# EAGLE design 608_donkey_nodisplay (EAGLE 9.6.2)
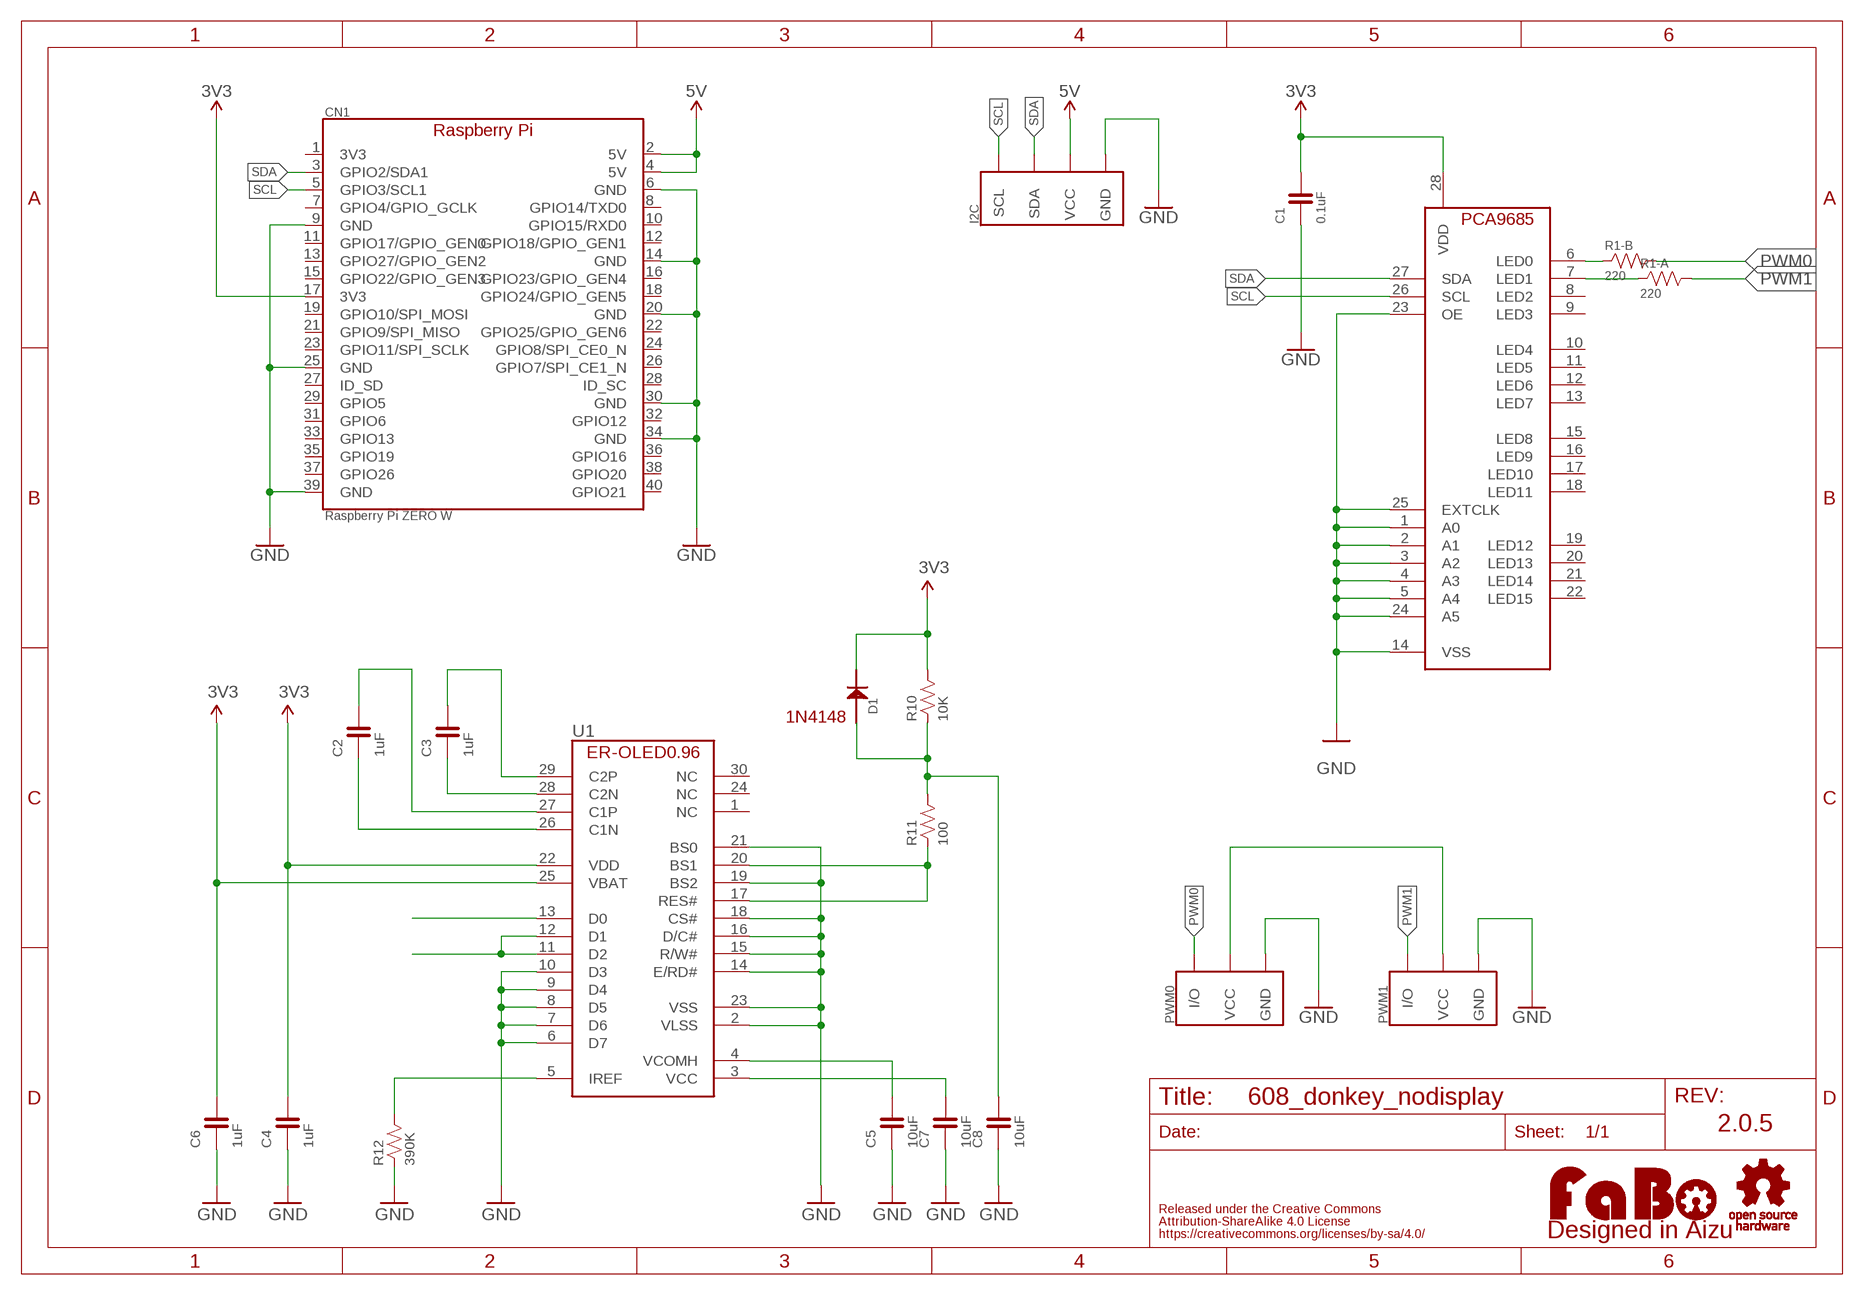
[diagram p0: schematic, sheet 1]

## Parts
C1  0.1uF  CAPACITOR-0603  [EIA0603]
C2  1uF  CAPACITOR-0603-BOTTOM  [0603-BOTTOM]
C3  1uF  CAPACITOR-0603-BOTTOM  [0603-BOTTOM]
C4  1uF  CAPACITOR-0603-BOTTOM  [0603-BOTTOM]
C5  10uF  CAPACITOR-0603-BOTTOM  [0603-BOTTOM]
C6  1uF  CAPACITOR-0603-BOTTOM  [0603-BOTTOM]
C7  10uF  CAPACITOR-0603-BOTTOM  [0603-BOTTOM]
C8  10uF  CAPACITOR-0603-BOTTOM  [0603-BOTTOM]
CN1  Raspberry Pi ZERO W  RASPBERRY_CON  [PIN_2X20_NARROW]
D1  1N4148  [1N4148W]
I2C  FABO-BRICK-I2C_SIDE_SMD_BOSS  [SM04B-PASS-1]
LOGO1  LOGO_FABO-M  [LOGO_FABO_M]
PWM0  FABO-BRICK-3PIN_HEADER  [PIN_1X3_NARROW]
PWM1  FABO-BRICK-3PIN_HEADER  [PIN_1X3_NARROW]
R1  220  RESISTOR_ARRAY_2  [EXBV4V]
R10  10K  RESISTOR-0603-BOTTOM  [0603-BOTTOM]
R11  100  RESISTOR-0603-BOTTOM  [0603-BOTTOM]
R12  390K  RESISTOR-0603-BOTTOM  [0603-BOTTOM]
U1  ER-OLED0.96-1ER-CON30HT-1  [ER-CON30HT-1]
U$4  PCA9685_BOTTOM  [PCA9685_BOTTOM]
U$5  LOGO_OSHW-M_BOTTOM  [LOGO_OSHW_M_BOTTOM]

## Nets
3V3: C1.2 C6.2 CN1.17(3V3) D1.CATHODE R10.2 U1.25(VBAT) U$4.28(VDD)
5V: CN1.2(5V) CN1.4(5V) I2C.3(VCC)
GND: C1.1 C4.1 C5.1 C6.1 C7.1 C8.1 CN1.6(GND) CN1.9(GND) CN1.14(GND) CN1.20(GND) CN1.25(GND) CN1.30(GND) CN1.34(GND) CN1.39(GND) I2C.4(GND) PWM0.3(GND) PWM1.3(GND) R12.1 U1.2(VLSS) U1.6(D7) U1.7(D6) U1.8(D5) U1.9(D4) U1.10(D3) U1.14(E/RD#) U1.15(R/W#) U1.16(D/C#) U1.18(CS#) U1.19(BS2) U1.21(BS0) U1.23(VSS) U$4.1(A0) U$4.2(A1) U$4.3(A2) U$4.4(A3) U$4.5(A4) U$4.14(VSS) U$4.23(OE) U$4.24(A5) U$4.25(EXTCLK)
N$1: PWM0.2(VCC) PWM1.2(VCC)
N$4: R1.2 U$4.6(LED0)
N$5: R1.1 U$4.7(LED1)
N$7: C2.1 U1.26(C1N)
N$14: C2.2 U1.27(C1P)
N$19: C3.1 U1.28(C2N)
N$21: C3.2 U1.29(C2P)
N$23: R12.2 U1.5(IREF)
N$24: C5.2 U1.4(VCOMH)
N$25: C7.2 U1.3(VCC)
N$26: R11.1 U1.17(RES#) U1.20(BS1)
N$27: C8.2 D1.ANODE R10.1 R11.2
N$30: C4.2 U1.22(VDD) ; supply symbol labelled 3V3
PWM0: PWM0.1(I/O) R1.3
PWM1: PWM1.1(I/O) R1.4
SCL: CN1.5(GPIO3/SCL1) I2C.1(SCL) U1.13(D0) U$4.26(SCL)
SDA: CN1.3(GPIO2/SDA1) I2C.2(SDA) U1.11(D2) U1.12(D1) U$4.27(SDA)
Unconnected: CN1.1(3V3) CN1.7(GPIO4/GPIO_GCLK) CN1.8(GPIO14/TXD0) CN1.10(GPIO15/RXD0) CN1.11(GPIO17/GPIO_GEN0) CN1.12(GPIO18/GPIO_GEN1) CN1.13(GPIO27/GPIO_GEN2) CN1.15(GPIO22/GPIO_GEN3) CN1.16(GPIO23/GPIO_GEN4) CN1.18(GPIO24/GPIO_GEN5) CN1.19(GPIO10/SPI_MOSI) CN1.21(GPIO9/SPI_MISO) CN1.22(GPIO25/GPIO_GEN6) CN1.23(GPIO11/SPI_SCLK) CN1.24(GPIO8/SPI_CE0_N) CN1.26(GPIO7/SPI_CE1_N) CN1.27(ID_SD) CN1.28(ID_SC) CN1.29(GPIO5) CN1.31(GPIO6) CN1.32(GPIO12) CN1.33(GPIO13) CN1.35(GPIO19) CN1.36(GPIO16) CN1.37(GPIO26) CN1.38(GPIO20) CN1.40(GPIO21) U1.1(NC) U1.24(NC) U1.30(NC) U$4.8(LED2) U$4.9(LED3) U$4.10(LED4) U$4.11(LED5) U$4.12(LED6) U$4.13(LED7) U$4.15(LED8) U$4.16(LED9) U$4.17(LED10) U$4.18(LED11) U$4.19(LED12) U$4.20(LED13) U$4.21(LED14) U$4.22(LED15)

## Notes on the sheet
- 1N4148
- 2.0.5

## Library data of the parts
C1 = component:CAPACITOR
C2-C8 = FaBo-Capacitor:CAPACITOR: CAPACITOR
CN1 = component:RASPBERRY_CON
D1 = FaBo-Diode:1N4148
I2C = component:FABO-BRICK-I2C
LOGO1 = component:LOGO_FABO
PWM0 PWM1 = component:FABO-BRICK-3PIN
R1 = component:RESISTOR_ARRAY_2
R10-R12 = FaBo-Resistors:RESISTOR: RESISTOR
U1 = FaBo-Display:ER-OLED0.96-1
U$4 = FaBo-Motor:PCA9685
U$5 = component:LOGO_OSHW

## Board
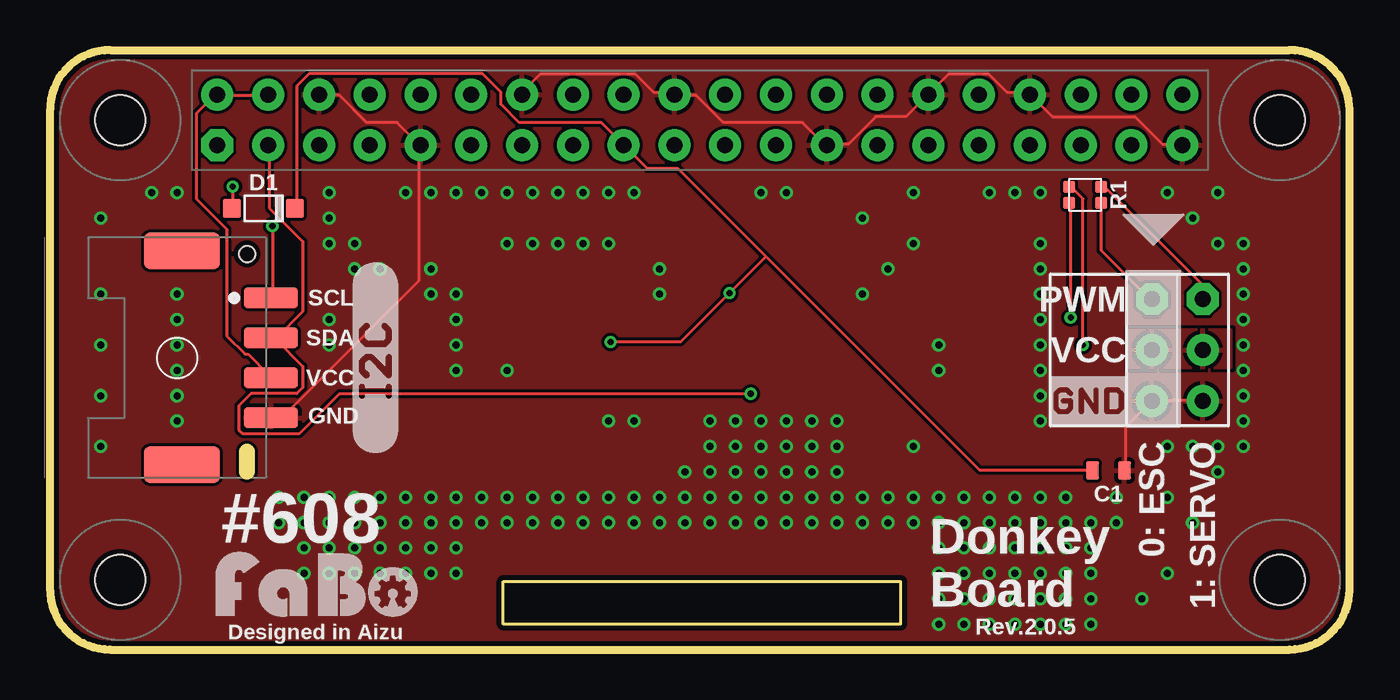
[diagram p1: board, top side]
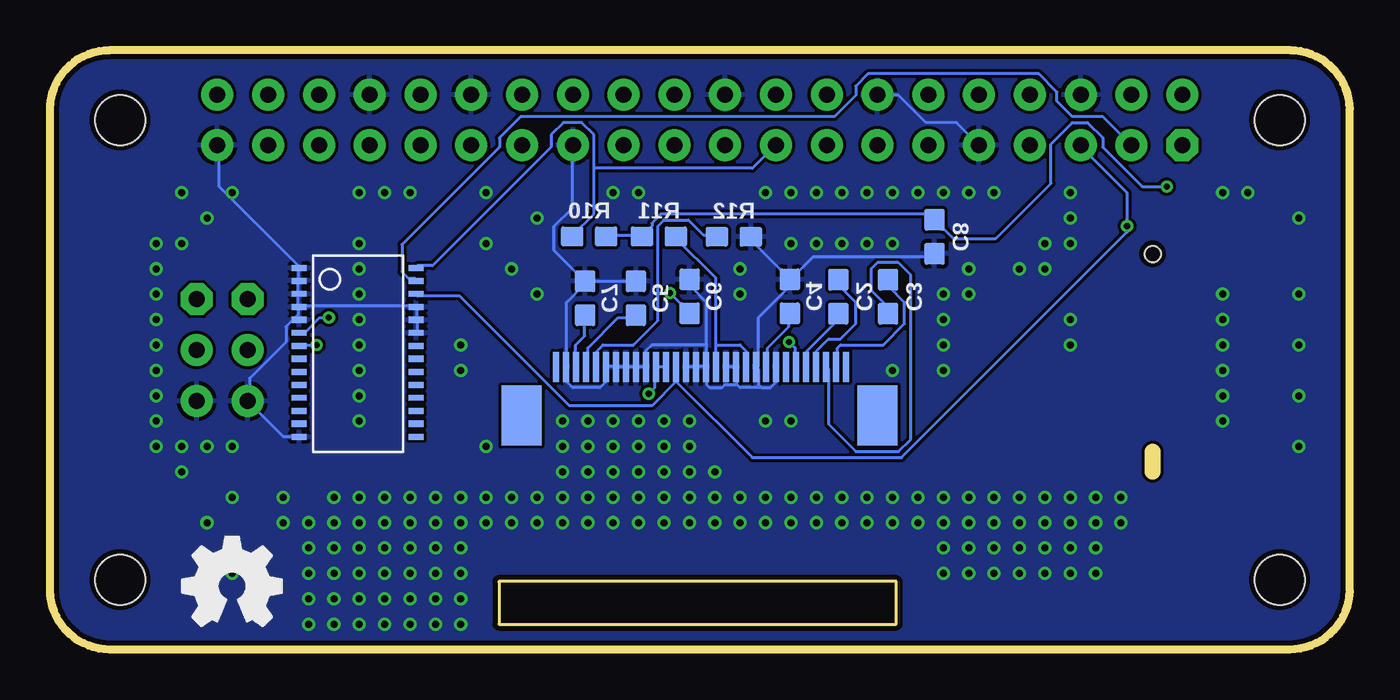
[diagram p2: board, bottom side, seen from below]

Size 65 x 30 mm. Coordinates in mm from the lower left corner, seen from the top.
Outline: 3,0 62,0 arc90 65,3 65,27 arc90 62,30 3,30 arc90 0,27 0,3 arc90 3,0
Outline: 22.67,3.41 42.54,3.41 42.54,1.27 22.67,1.27 22.67,3.41
Copper layers (1*16): Top 0.035mm / dielectric 1.6mm / Bottom 0.035mm
Design rules "PCBway": minimum track width 6mil, minimum drill 12mil, track to track 6mil, track to pad 6mil, pad to pad 6mil, via to via 6mil, smd to smd 6mil, copper to edge 10mil, drill to drill 10mil, minimum pad ring 10mil, minimum via ring 6mil, stop-mask expansion 2mil, vias tented up to drill 100mil, thermal gap 8mil
Holes 2.5 mm at 3.5,3.5 3.5,26.5 61.5,26.5 61.5,3.5

### Footprints (pad centres in the part's own frame; a part is rotated, then mirrored left to right if it is on the bottom)
EIA0603 = smd 0.65 x 0.9: 1 -0.8,0; 2 0.8,0
0603-BOTTOM = smd 1.1 x 1 bottom: 1 -0.85,0; 2 0.85,0
PIN_2X20_NARROW = drill 0.8 pad 1.6 octagon: 1 -24.13,-1.27 | drill 0.8 pad 1.6: 2 -24.13,1.27; 3 -21.59,-1.27; 4 -21.59,1.27; 5 -19.05,-1.27; 6 -19.05,1.27; 7 -16.51,-1.27; 8 -16.51,1.27; 9 -13.97,-1.27; 10 -13.97,1.27; 11 -11.43,-1.27; 12 -11.43,1.27; 13 -8.89,-1.27; 14 -8.89,1.27; 15 -6.35,-1.27; 16 -6.35,1.27; 17 -3.81,-1.27; 18 -3.81,1.27; 19 -1.27,-1.27; 20 -1.27,1.27; 21 1.27,-1.27; 22 1.27,1.27; 23 3.81,-1.27; 24 3.81,1.27; 25 6.35,-1.27; 26 6.35,1.27; 27 8.89,-1.27; 28 8.89,1.27; 29 11.43,-1.27; 30 11.43,1.27; 31 13.97,-1.27; 32 13.97,1.27; 33 16.51,-1.27; 34 16.51,1.27; 35 19.05,-1.27; 36 19.05,1.27; 37 21.59,-1.27; 38 21.59,1.27; 39 24.13,-1.27; 40 24.13,1.27
1N4148W = smd 0.9 x 0.95: ANODE 0,0; CATHODE 3.15,0
SM04B-PASS-1 = smd 1 x 2.7: 1 3,-11.85; 2 1,-11.85; 3 -1,-11.85; 4 -3,-11.85 | smd 1.8 x 3.8: P$1 5.35,-7.4; P$2 -5.35,-7.4 | hole 0.8: 5.2,-10.65
PIN_1X3_NARROW = drill 0.8 pad 1.6 octagon: 1 -2.54,0 | drill 0.8 pad 1.6: 2 0,0; 3 2.54,0
EXBV4V = smd 0.6 x 0.6: 1 -0.4,-0.8; 2 0.4,-0.8; 3 0.4,0.8; 4 -0.4,0.8
ER-CON30HT-1 = smd 0.3 x 1.5 bottom: 1 7,-0.23; 2 6.5,-0.23; 3 6,-0.23; 4 5.5,-0.23; 5 5,-0.23; 6 4.5,-0.23; 7 4,-0.23; 8 3.5,-0.23; 9 3,-0.23; 10 2.5,-0.23; 11 2,-0.23; 12 1.5,-0.23; 13 1,-0.23; 14 0.5,-0.23; 15 0,-0.23; 16 -0.5,-0.23; 17 -1,-0.23; 18 -1.5,-0.23; 19 -2,-0.23; 20 -2.5,-0.23; 21 -3,-0.23; 22 -3.5,-0.23; 23 -4,-0.23; 24 -4.5,-0.23; 25 -5,-0.23; 26 -5.5,-0.23; 27 -6,-0.23; 28 -6.5,-0.23; 29 -7,-0.23; 30 -7.5,-0.23 | smd 2 x 3 bottom: 31 -9.07,-2.67; 32 8.74,-2.67
PCA9685_BOTTOM = smd 0.3 x 0.75 bottom: 1 4.3,-2.93; 2 3.65,-2.93; 3 3,-2.93; 4 2.35,-2.93; 5 1.7,-2.93; 6 1.05,-2.93; 7 0.4,-2.93; 8 -0.25,-2.93; 9 -0.9,-2.93; 10 -1.55,-2.93; 11 -2.2,-2.93; 12 -2.85,-2.93; 13 -3.5,-2.93; 14 -4.15,-2.93; 15 -4.15,2.92; 16 -3.5,2.92; 17 -2.85,2.92; 18 -2.2,2.92; 19 -1.55,2.92; 20 -0.9,2.92; 21 -0.25,2.92; 22 0.4,2.92; 23 1.05,2.92; 24 1.7,2.92; 25 2.35,2.92; 26 3,2.92; 27 3.65,2.92; 28 4.3,2.92

### Placement (x,y rotation side)
C1  52.94,8.96 180 top
C2  25.57,17.66 90 top
C3  23.09,17.66 90 top
C4  28,17.67 270 top
C5  35.69,17.58 270 top
C6  33.01,17.67 270 top
C7  38.23,17.58 270 top
C8  20.76,20.66 90 top
CN1  32.5,26.5 0 top
D1  9.1,22.08 0 top
I2C  -0.8,14.6 90 top
LOGO1  13.34,1.27 0 top
PWM0  55.12,14.99 270 top
PWM1  57.66,14.99 270 top
R1  51.77,22.75 270 top
R10  38.03,20.67 0 top
R11  34.54,20.67 0 top
R12  30.79,20.66 0 top
U1  32.68,14.38 0 top
U$2  [LOGO_SILK_I2C]  17.45,14.6 90 top
U$3  [LOGO_SILK_GND]  50.04,11.18 0 top
U$4  49.6,14.8 90 top
U$5  55.88,3.17 0 top

### Tracks (layer width: path | path; a pad name or v marks a point on that pad's centre or on a via)
3V3  (via drill 0.3)
  Top 0.152: 35.81,19.66 31.39,24.08 29.87,24.08 28.8,25.15 CN1.17 28.65,25.3 27.58,26.36 23.47,26.36 22.55,27.28 22.55,27.89 21.64,28.8 12.95,28.8 12.34,28.19 12.34,22.1 D1.CATHODE | 35.81,19.66 46.48,8.99 52.12,8.99 C1.2 | 35.81,19.66 v33.98,17.83 31.55,15.39 v28.04,15.39
  Bottom 0.152: 37.8,24.08 37.8,21.79 38.86,20.73 R10.2 | 37.8,24.08 37.8,25.76 38.41,26.36 39.32,26.36 39.93,25.76 39.93,25.15 45.87,19.2 46.63,19.2 U$4.28 | v33.98,17.83 33.07,16.92 C6.2 | v28.04,15.39 27.74,15.09 27.74,14.17 U1.25 | 37.8,24.08 29.87,24.08 28.8,25.15 CN1.17
5V
  Top 0.152: I2C.3 10.97,13.72 9.91,14.78 9.75,14.78 8.84,15.7 8.84,21.03 7.32,22.55 7.32,26.82 8.23,27.74 CN1.2 8.38,27.74 10.82,27.74 CN1.4
GND  (via drill 0.35)
  Top 0.152: I2C.4 11.12,11.73 11.73,11.73 18.44,18.44 18.44,25.15 CN1.9 18.44,25.3 17.37,26.36 15.85,26.36 14.48,27.74 13.56,27.74 CN1.6 | CN1.14 23.62,27.89 24.54,28.8 29.26,28.8 30.18,27.89 31.09,27.89 CN1.20 31.24,27.74 32.31,27.74 33.68,26.36 37.64,26.36 38.71,25.3 CN1.25 38.86,25.3 39.93,25.3 41.3,26.67 42.82,26.67 43.89,27.74 CN1.30 44.04,27.89 44.96,28.8 46.94,28.8 47.85,27.89 48.92,27.89 CN1.34 49.07,27.74 50.14,26.67 54.25,26.67 55.63,25.3 56.54,25.3 CN1.39 | C1.1 53.8,8.99 53.8,11.12 PWM0.3 55.17,12.5 57.61,12.5 PWM1.3
  Bottom 0.152: CN1.14 23.47,27.74 22.55,27.74 21.18,26.36 19.66,26.36 18.59,25.3 CN1.9 | U$4.14 52.58,10.67 53.34,10.67 PWM0.3 55.02,12.5 55.02,13.56 53.19,15.39 53.19,16.15 52.58,16.76 | U$4.23 46.63,15.85 46.63,16.46 U$4.24 46.63,16.61 46.63,17.07 U$4.25 46.79,17.22 52.43,17.22 U$4.4 | 52.58,16.76 52.58,17.07 U$4.4 | 52.58,16.76 52.58,16.61 U$4.5 | U$4.4 52.58,17.22 52.58,17.68 U$4.3 52.58,17.83 52.58,18.44 U$4.2 52.58,18.59 52.58,19.05 U$4.1 52.58,19.2 56.54,23.16 56.54,25.15 CN1.39 | C4.1 28.04,18.59 30.02,20.57 R12.1 | C8.1 20.88,19.66 26.82,19.66 27.89,18.59 C4.1 | C5.1 35.81,18.44 38.1,18.44 C7.1 | 35.2,14.17 35.66,14.17 U1.9 35.81,14.17 36.12,14.17 U1.8 36.27,14.17 36.58,14.17 U1.7 36.73,14.17 37.03,14.17 U1.6 37.19,14.02 37.19,13.41 37.49,13.11 38.86,13.11 39.17,13.41 39.17,14.02 U1.2 39.17,14.17 39.17,17.37 38.25,18.29 C7.1 | U1.18 31.09,14.17 30.79,14.17 U1.19 30.63,14.02 30.63,13.26 | 29.41,13.11 28.96,13.11 28.65,13.41 28.65,14.02 U1.23 | 29.41,13.11 29.57,13.26 29.57,14.02 U1.21 29.57,14.17 29.57,16.61 28.04,18.14 28.04,18.44 C4.1 | 30.63,13.26 30.48,13.11 29.41,13.11 | U1.14 33.07,14.17 32.77,14.17 U1.15 32.61,14.17 32.31,14.17 U1.16 | 32.16,15.24 32.16,14.17 U1.16 | 32.16,15.24 32.16,17.37 32.92,18.14 32.92,18.44 C6.1 | 30.63,13.26 31.24,13.26 31.39,13.11 32,13.11 32.16,13.26 32.16,14.02 U1.16 | 35.2,14.17 35.2,14.94 34.9,15.24 32.16,15.24 | 35.2,14.17 U1.10 | CN1.25 38.86,25.15 38.86,22.1 39.78,21.18 39.78,19.96 38.25,18.44 C7.1
  other vias: 21.59,7.62 22.86,7.62 20.32,7.62 20.32,6.35 21.59,6.35 22.86,6.35 24.13,6.35 25.4,6.35 26.67,6.35 27.94,6.35 27.94,7.62 26.67,7.62 25.4,7.62 24.13,7.62 27.94,11.43 29.21,11.43 22.86,13.97 20.32,13.97 20.32,15.24 20.32,16.51 20.32,17.78 19.05,17.78 19.05,19.05 22.86,20.32 24.13,20.32 25.4,20.32 26.67,20.32 27.94,20.32 30.48,19.05 30.48,17.78 29.21,7.62 12.7,7.62 13.97,7.62 11.43,7.62 11.43,6.35 12.7,6.35 13.97,6.35 15.24,6.35 16.51,6.35 17.78,6.35 19.05,6.35 19.05,7.62 17.78,7.62 16.51,7.62 15.24,7.62 13.97,5.08 15.24,5.08 12.7,5.08 12.7,3.81 13.97,3.81 15.24,3.81 16.51,3.81 17.78,3.81 19.05,3.81 20.32,3.81 20.32,5.08 19.05,5.08 17.78,5.08 16.51,5.08 45.72,5.08 46.99,5.08 44.45,5.08 44.45,3.81 45.72,3.81 46.99,3.81 48.26,3.81 49.53,3.81 50.8,3.81 52.07,3.81 52.07,5.08 50.8,5.08 49.53,5.08 48.26,5.08 41.91,7.62 43.18,7.62 40.64,7.62 40.64,6.35 41.91,6.35 43.18,6.35 44.45,6.35 45.72,6.35 46.99,6.35 48.26,6.35 48.26,7.62 46.99,7.62 45.72,7.62 44.45,7.62 45.72,2.54 46.99,2.54 44.45,2.54 44.45,1.27 45.72,1.27 46.99,1.27 48.26,1.27 49.53,1.27 50.8,1.27 52.07,1.27 52.07,2.54 50.8,2.54 49.53,2.54 48.26,2.54 31.75,7.62 33.02,7.62 30.48,7.62 30.48,6.35 31.75,6.35 33.02,6.35 34.29,6.35 35.56,6.35 36.83,6.35 38.1,6.35 38.1,7.62 36.83,7.62 35.56,7.62 34.29,7.62 29.21,6.35 39.37,7.62 39.37,6.35 39.37,8.89 39.37,10.16 39.37,11.43 38.1,11.43 36.83,11.43 35.56,11.43 34.29,11.43 33.02,11.43 33.02,10.16 34.29,10.16 35.56,10.16 36.83,10.16 38.1,10.16 38.1,8.89 36.83,8.89 35.56,8.89 34.29,8.89 33.02,8.89 31.75,8.89 49.53,7.62 50.8,7.62 50.8,6.35 49.53,6.35 52.07,6.35 53.34,6.35 53.34,7.62 55.88,10.16 57.15,10.16 58.42,10.16 59.69,10.16 59.69,11.43 59.69,12.7 59.69,13.97 59.69,15.24 59.69,16.51 59.69,17.78 59.69,19.05 59.69,20.32 49.53,11.43 49.53,12.7 49.53,13.97 49.53,15.24 49.53,16.51 49.53,17.78 49.53,19.05 49.53,20.32 6.35,17.78 6.35,16.51 6.35,15.24 6.35,13.97 6.35,12.7 6.35,11.43 17.78,22.86 19.05,22.86 20.32,22.86 21.59,22.86 22.86,22.86 24.13,22.86 25.4,22.86 26.67,22.86 27.94,22.86 29.21,22.86 13.97,22.86 13.97,21.59 13.97,20.32 15.24,20.32 15.24,19.05 16.51,19.05 13.97,15.24 13.97,16.51 6.35,22.86 5.08,22.86 41.91,19.05 40.64,17.78 40.64,21.59 43.18,22.86 46.99,22.86 48.26,22.86 49.53,22.86 55.88,22.86 57.15,21.59 58.42,22.86 58.42,20.32 55.88,7.62 58.42,8.89 57.15,6.35 55.88,3.81 54.61,2.54 43.18,10.16 44.45,13.97 44.45,15.24 43.18,20.32 35.56,22.86 36.83,22.86 2.54,21.59 2.54,17.78 2.54,15.24 2.54,12.7 2.54,10.16
  pour Top (rank 2): 0,0 64.77,0 64.77,6.35 64.77,30.48 0,30.48
  pour Bottom (rank 2): 0,0 64.77,0 64.77,30.48 0,30.48
N$1
  pour Top: 53.98,16 59.05,16 59.05,14.1 53.98,14.1
N$4  (via drill 0.3)
  Top 0.152: v51.05,16.61 51.05,22.25 R1.2
  Bottom 0.152: v51.05,16.61 51.51,16.61 52.27,15.85 52.43,15.85 U$4.6
N$5  (via drill 0.3)
  Top 0.152: v51.66,15.24 51.66,22.55 51.21,23.01 51.05,23.01 R1.1
  Bottom 0.152: v51.66,15.24 52.43,15.24 U$4.7
N$7
  Bottom 0.152: C2.1 25.6,16.76 25.6,16.46 27.13,14.94 27.13,14.17 U1.26
N$14
  Bottom 0.152: C2.2 25.45,18.44 25.45,18.14 24.69,17.37 24.69,16.31 25.45,15.54 26.06,15.54 26.67,14.94 26.67,14.17 U1.27
N$19
  Bottom 0.152: C3.1 23.16,16.92 23.16,17.22 23.93,17.98 23.93,19.05 23.62,19.36 22.55,19.36 21.95,18.75 21.95,10.52 22.55,9.91 24.69,9.91 26.06,11.28 26.06,14.02 U1.28
N$21
  Bottom 0.152: C3.2 23.01,18.44 23.01,18.14 22.25,17.37 22.25,16.31 23.32,15.24 25.45,15.24 25.6,15.09 25.6,14.17 U1.29
N$23
  Bottom 0.152: R12.2 31.7,20.73 32.31,20.73 33.07,21.49 34.29,21.49 34.59,21.18 34.59,16.46 35.81,15.24 37.34,15.24 37.64,14.94 37.64,14.17 U1.5
N$24
  Bottom 0.152: C5.2 35.81,16.61 36.58,16.61 38.1,15.09 38.1,14.17 U1.4
N$25
  Bottom 0.152: C7.2 38.25,16.61 38.25,15.7 38.71,15.24 38.71,14.17 U1.3
N$26
  Bottom 0.152: 31.7,15.24 31.7,14.17 U1.17 | 31.7,15.24 31.7,18.59 33.68,20.57 R11.1 | 31.7,15.24 30.48,15.24 30.18,14.94 30.18,14.17 U1.20
N$27  (via drill 0.3)
  Top 0.152: v9.14,23.16 9.14,22.1 D1.ANODE
  Bottom 0.152: R10.1 37.03,20.73 35.51,20.73 R11.2 35.36,20.73 34.9,21.18 34.9,21.34 34.44,21.79 21.03,21.79 20.88,21.64 C8.2 20.73,21.49 19.81,20.57 17.68,20.57 14.94,23.32 14.94,25.3 13.87,26.36 13.11,26.36 12.34,25.6 12.34,25.15 10.36,23.16 v9.14,23.16
N$30
  Bottom 0.152: C4.2 28.04,16.76 28.04,16.15 29.11,15.09 29.11,14.17 U1.22
PWM0
  Top 0.152: R1.3 52.58,22.25 52.58,19.96 55.02,17.53 PWM0.1
PWM1
  Top 0.152: R1.4 52.58,23.01 52.88,23.01 57.61,18.29 57.61,17.53 PWM1.1
SCL  (via drill 0.3)
  Top 0.152: v11.12,21.18 11.12,17.68 I2C.1
  Bottom 0.152: CN1.5 13.41,25.15 11.12,22.86 v11.12,21.18 11.12,20.88 22.4,9.6 29.87,9.6 33.68,13.41 | 33.68,13.41 34.9,12.19 39.01,12.19 44.5,17.68 46.63,17.68 U$4.26 | 33.68,13.41 33.68,14.02 U1.13 33.68,13.41
SDA  (via drill 0.3)
  Top 0.152: v35.05,12.8 14.48,12.8 12.5,10.82 9.6,10.82 9.45,10.97 9.45,12.19 10.06,12.8 12.34,12.8 12.65,13.11 12.65,14.17 11.28,15.54 | 11.28,15.54 11.12,15.7 I2C.2 11.28,15.54 | 11.28,15.54 12.65,16.92 12.65,20.42 10.97,22.1 10.97,25.15 CN1.3
  Bottom 0.152: U1.12 34.29,14.17 34.59,14.17 U1.11 34.75,14.02 34.75,13.11 v35.05,12.8 | U$4.27 46.79,18.59 47.09,18.59 47.4,18.9 47.4,20.27 42.52,25.15 42.52,25.6 41.45,26.67 25.76,26.67 24.69,27.74 24.69,28.19 24.08,28.8 15.54,28.8 14.63,27.89 14.63,27.43 13.87,26.67 12.34,26.67 10.97,25.3 CN1.3

### Text on the board
tPlace: SCL | PWM | SDA | VCC | VCC | GND | 0: ESC | 1: SERVO | #608 | Donkey / Board | Designed in Aizu | Rev.2.0.5